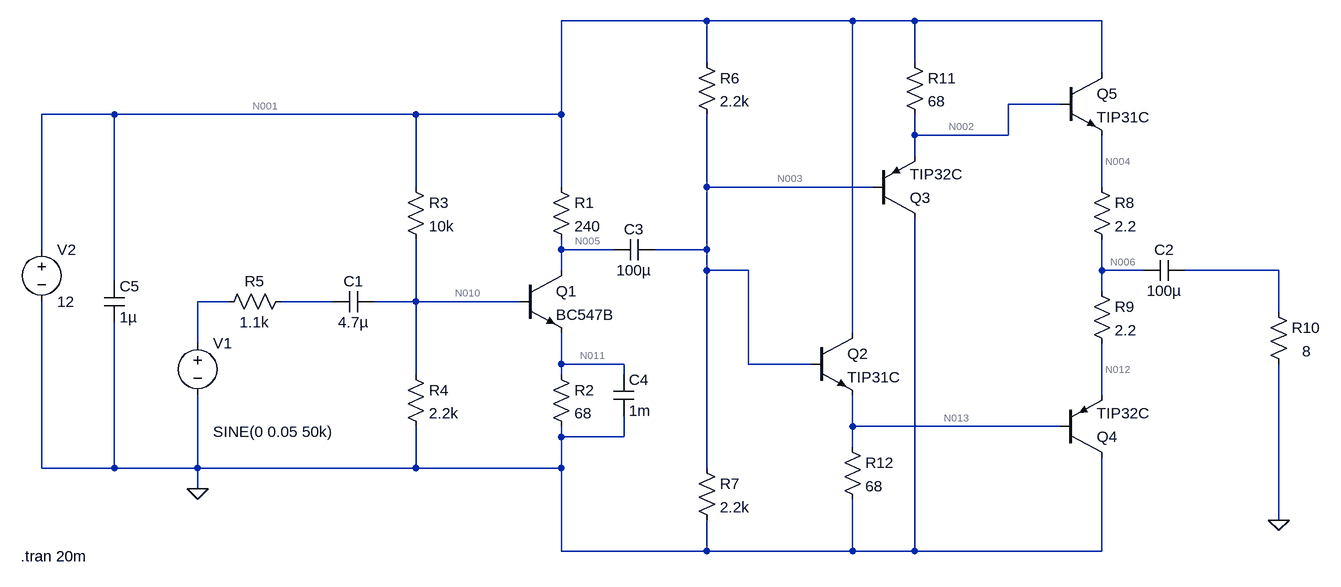
[diagram p0: schematic schematic.asc]
schematic.asc, the LTspice schematic file:
Version 4
SHEET 1 1604 680
WIRE 656 -288 432 -288
WIRE 880 -288 656 -288
WIRE 976 -288 880 -288
WIRE 1264 -288 976 -288
WIRE 656 -224 656 -288
WIRE 976 -224 976 -288
WIRE 1264 -208 1264 -288
WIRE 1200 -160 1120 -160
WIRE -256 -144 -368 -144
WIRE 208 -144 -256 -144
WIRE 432 -144 432 -288
WIRE 432 -144 208 -144
WIRE 976 -112 976 -144
WIRE 1120 -112 1120 -160
WIRE 1120 -112 976 -112
WIRE 976 -80 976 -112
WIRE 208 -32 208 -144
WIRE 432 -32 432 -144
WIRE 656 -32 656 -144
WIRE 912 -32 656 -32
WIRE 1264 -32 1264 -112
WIRE -368 64 -368 -144
WIRE 432 64 432 48
WIRE 512 64 432 64
WIRE 656 64 656 -32
WIRE 656 64 576 64
WIRE 432 96 432 64
WIRE 656 96 656 64
WIRE 720 96 656 96
WIRE 1264 96 1264 48
WIRE 1328 96 1264 96
WIRE 1536 96 1392 96
WIRE -256 112 -256 -144
WIRE 1264 128 1264 96
WIRE -80 144 -128 144
WIRE 80 144 0 144
WIRE 208 144 208 48
WIRE 208 144 144 144
WIRE 368 144 208 144
WIRE 1536 160 1536 96
WIRE 880 192 880 -288
WIRE -128 208 -128 144
WIRE 432 240 432 192
WIRE 528 240 432 240
WIRE 720 240 720 96
WIRE 816 240 720 240
WIRE 208 256 208 144
WIRE 432 256 432 240
WIRE 528 256 528 240
WIRE 1264 288 1264 208
WIRE 880 336 880 288
WIRE 1200 336 880 336
WIRE 432 352 432 336
WIRE 528 352 528 320
WIRE 528 352 432 352
WIRE 880 368 880 336
WIRE -368 400 -368 144
WIRE -256 400 -256 176
WIRE -256 400 -368 400
WIRE -128 400 -128 288
WIRE -128 400 -256 400
WIRE 208 400 208 336
WIRE 208 400 -128 400
WIRE 432 400 432 352
WIRE 432 400 208 400
WIRE 656 400 656 96
WIRE -128 432 -128 400
WIRE 1536 480 1536 240
WIRE 432 528 432 400
WIRE 656 528 656 480
WIRE 656 528 432 528
WIRE 880 528 880 448
WIRE 880 528 656 528
WIRE 976 528 976 16
WIRE 976 528 880 528
WIRE 1264 528 1264 384
WIRE 1264 528 976 528
FLAG -128 432 0
FLAG 1536 480 0
SYMBOL npn 368 96 R0
SYMATTR InstName Q1
SYMATTR Value BC547B
SYMBOL res 416 -48 R0
SYMATTR InstName R1
SYMATTR Value 240
SYMBOL res 416 240 R0
SYMATTR InstName R2
SYMATTR Value 68
SYMBOL res 192 -48 R0
SYMATTR InstName R3
SYMATTR Value 10k
SYMBOL res 192 240 R0
SYMATTR InstName R4
SYMATTR Value 2.2k
SYMBOL cap 144 128 R90
WINDOW 0 0 32 VBottom 2
WINDOW 3 32 32 VTop 2
SYMATTR InstName C1
SYMATTR Value 4.7µ
SYMBOL res 16 128 R90
WINDOW 0 0 56 VBottom 2
WINDOW 3 32 56 VTop 2
SYMATTR InstName R5
SYMATTR Value 1.1k
SYMBOL voltage -368 48 R0
WINDOW 123 0 0 Left 0
WINDOW 39 0 0 Left 0
SYMATTR InstName V2
SYMATTR Value 12
SYMBOL res 640 -240 R0
SYMATTR InstName R6
SYMATTR Value 2.2k
SYMBOL res 640 384 R0
SYMATTR InstName R7
SYMATTR Value 2.2k
SYMBOL npn 816 192 R0
SYMATTR InstName Q2
SYMATTR Value TIP31C
SYMBOL pnp 912 16 M180
SYMATTR InstName Q3
SYMATTR Value TIP32C
SYMBOL pnp 1200 384 M180
SYMATTR InstName Q4
SYMATTR Value TIP32C
SYMBOL npn 1200 -208 R0
SYMATTR InstName Q5
SYMATTR Value TIP31C
SYMBOL res 1248 -48 R0
SYMATTR InstName R8
SYMATTR Value 2.2
SYMBOL res 1248 112 R0
SYMATTR InstName R9
SYMATTR Value 2.2
SYMBOL res 1520 144 R0
WINDOW 3 52 76 Left 2
SYMATTR Value 8
SYMATTR InstName R10
SYMBOL res 960 -240 R0
SYMATTR InstName R11
SYMATTR Value 68
SYMBOL res 864 352 R0
SYMATTR InstName R12
SYMATTR Value 68
SYMBOL cap 1392 80 R90
WINDOW 0 0 32 VBottom 2
WINDOW 3 32 32 VTop 2
SYMATTR InstName C2
SYMATTR Value 100µ
SYMBOL cap 576 48 R90
WINDOW 0 0 32 VBottom 2
WINDOW 3 32 32 VTop 2
SYMATTR InstName C3
SYMATTR Value 100µ
SYMBOL cap 512 256 R0
SYMATTR InstName C4
SYMATTR Value 1m
SYMBOL voltage -128 192 R0
WINDOW 3 24 152 Left 2
WINDOW 123 24 44 Left 2
WINDOW 39 0 0 Left 0
SYMATTR Value SINE(0 0.05 50k)
SYMATTR InstName V1
SYMBOL cap -272 112 R0
SYMATTR InstName C5
SYMATTR Value 1µ
TEXT -400 536 Left 2 !.tran 20m

The netlist it stands for:
* schematic.asc
Q1 N005 N010 N011 0 BC547B
R1 N001 N005 240
R2 N011 0 68
R3 N001 N010 10k
R4 N010 0 2.2k
C1 N010 N009 4.7µ
R5 N009 N008 1.1k
V2 N001 0 12
R6 N001 N003 2.2k
R7 N003 0 2.2k
Q2 N001 N003 N013 0 TIP31C
Q3 0 N003 N002 0 TIP32C
Q4 0 N013 N012 0 TIP32C
Q5 N001 N002 N004 0 TIP31C
R8 N004 N006 2.2
R9 N006 N012 2.2
R10 N007 0 8
R11 N001 N002 68
R12 N013 0 68
C2 N007 N006 100µ
C3 N003 N005 100µ
C4 N011 0 1m
V1 N008 0 SINE(0 0.05 50k)
C5 N001 0 1µ
.model NPN NPN
.model PNP PNP
.lib standard.bjt
.tran 20m
.backanno
.end

* Results of the author's LTspice run, read from the files saved beside the schematic
* Operating Point, zero values left out:
*   V(n005) = 7.388 V
*   V(n010) = 2.037 V
*   V(n011) = 1.312 V
*   V(n001) = 12 V
*   V(n003) = 5.99 V
*   V(n013) = 5.364 V
*   V(n002) = 6.719 V
*   V(n012) = 6.051 V
*   V(n004) = 6.132 V
*   V(n006) = 6.092 V
*   Ic(Q4) = -18.11 mA
*   Ib(Q4) = -190.8 µA
*   Ie(Q4) = 18.3 mA
*   Ic(Q3) = -76.69 mA
*   Ib(Q3) = -749.4 µA
*   Ie(Q3) = 77.44 mA
*   Ic(Q5) = 18.07 mA
*   Ib(Q5) = 224.5 µA
*   Ie(Q5) = -18.3 mA
*   Ic(Q2) = 77.93 mA
*   Ib(Q2) = 758.4 µA
*   Ie(Q2) = -78.69 mA
*   Ic(Q1) = 19.22 mA
*   Ib(Q1) = 70.3 µA
*   Ie(Q1) = -19.29 mA
*   I(R12) = 78.88 mA
*   I(R11) = 77.66 mA
*   I(R9) = 18.3 mA
*   I(R8) = 18.3 mA
*   I(R7) = 2.723 mA
*   I(R6) = 2.732 mA
*   I(R4) = 926 µA
*   I(R3) = 996.3 µA
*   I(R2) = 19.29 mA
*   I(R1) = 19.22 mA
*   I(V2) = -196.6 mA